# Altium project Autoinformer_v1.1.PrjPcb (part 1 of 2)
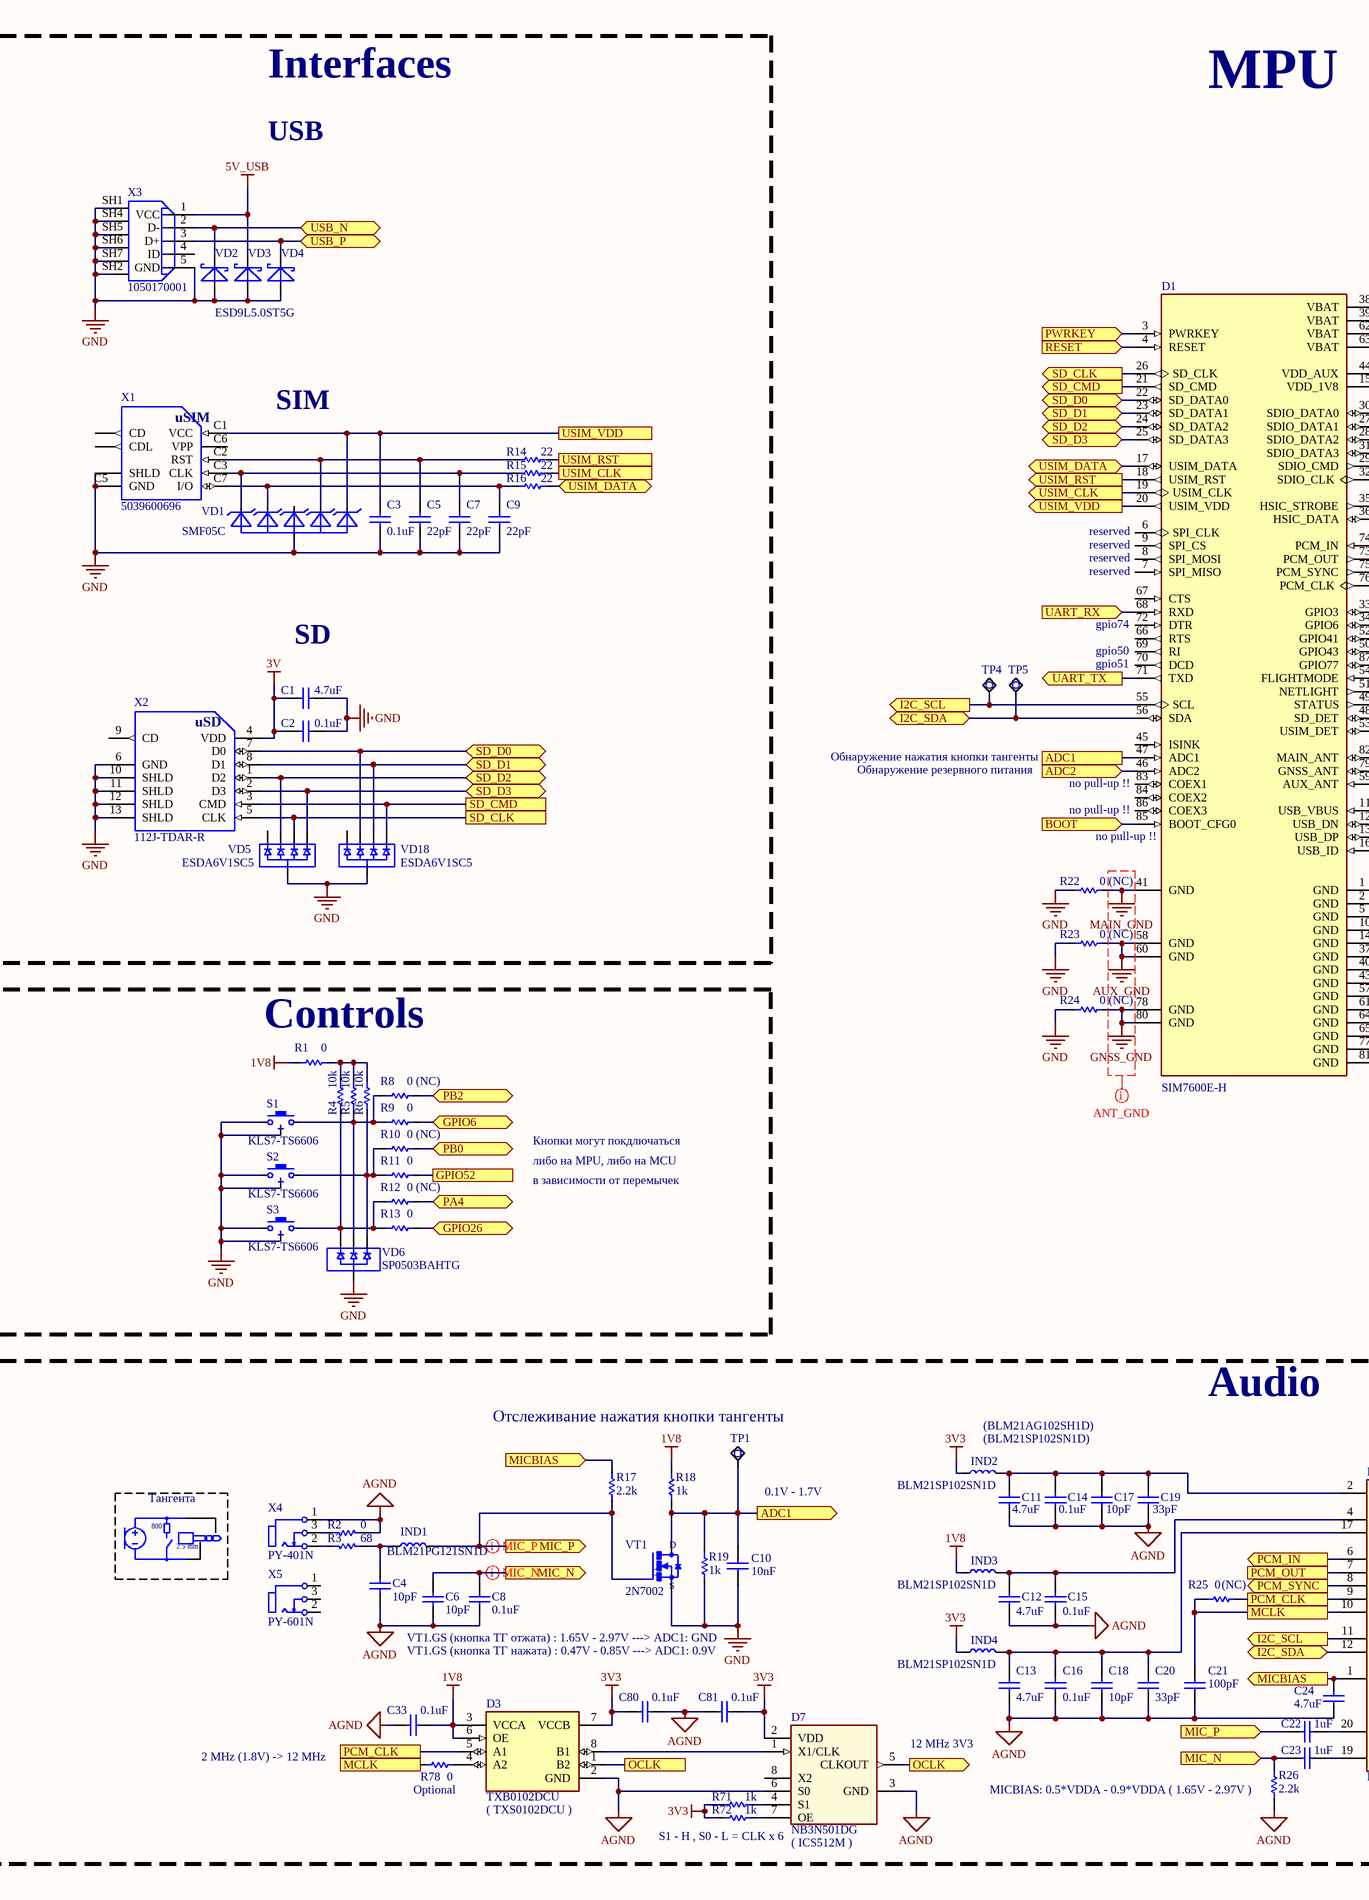
[diagram p0: Sh1_MPU.SchDoc, left]
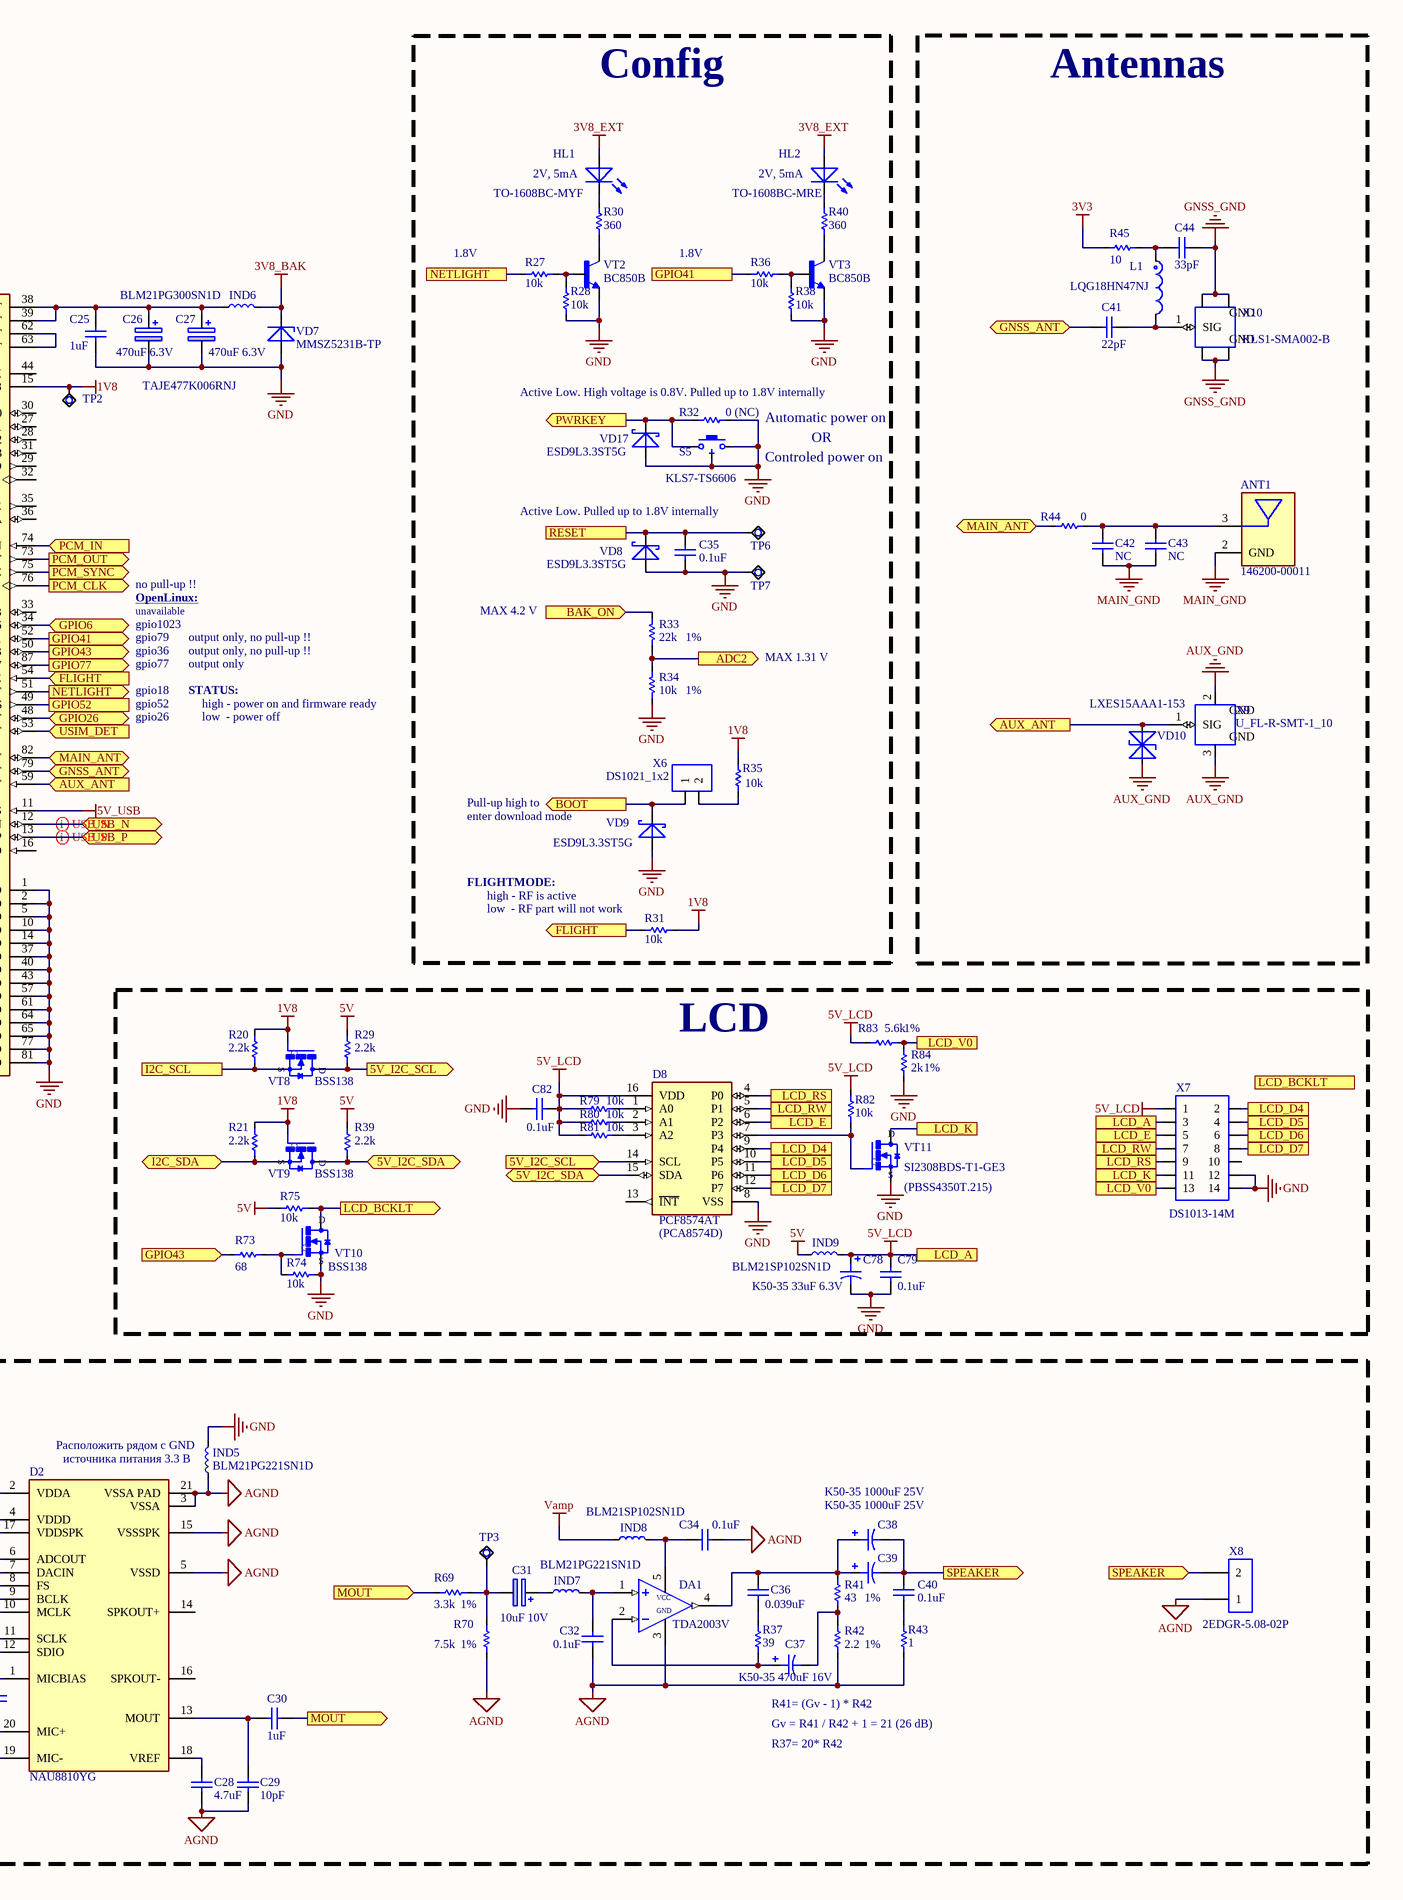
[diagram p1: Sh1_MPU.SchDoc, right]
3 sheets, 272 parts. Net scope: flat (ports and power ports of the same name join across sheets).
Board file: AutoinformerPCB.PcbDoc
Sheets:
  Sh1_MPU.SchDoc
  Sh2_MCU.SchDoc
  Sh3_Power.SchDoc

## Sheet Sh1_MPU.SchDoc
size A2

### Parts
ANT1  146200-00011  [Molex_146200-0011_MFG]
C1  4.7uF  [C_SMD0603]
C2  0.1uF  [C_SMD0603]
C3  0.1uF  [C_SMD0603]
C4  10pF  [C_SMD0603]
C5  22pF  [C_SMD0603]
C6  10pF  [C_SMD0603]
C7  22pF  [C_SMD0603]
C8  0.1uF  [C_SMD0603]
C9  22pF  [C_SMD0603]
C10  10nF  [C_SMD0603]
C11  4.7uF  [C_SMD0603]
C12  4.7uF  [C_SMD0603]
C13  4.7uF  [C_SMD0603]
C14  0.1uF  [C_SMD0603]
C15  0.1uF  [C_SMD0603]
C16  0.1uF  [C_SMD0603]
C17  10pF  [C_SMD0603]
C18  10pF  [C_SMD0603]
C19  33pF  [C_SMD0603]
C20  33pF  [C_SMD0603]
C21  100pF  [C_SMD0603]
C22  1uF  [C_SMD0603]
C23  1uF  [C_SMD0603]
C24  4.7uF  [C_SMD0603]
C25  1uF  [C_SMD0603]
C26  470uF 6.3V  [TECAP_E]
C27  470uF 6.3V  [TECAP_E]
C28  4.7uF  [C_SMD0603]
C29  10pF  [C_SMD0603]
C30  1uF  [C_SMD1206]
C31  10uF 10V  [TECAP_B]
C32  0.1uF  [C_SMD0603]
C33  0.1uF  [C_SMD0402]
C34  0.1uF  [C_SMD0603]
C35  0.1uF  [C_SMD0603]
C36  0.039uF  [C_SMD0603]
C37  K50-35 470uF 16V  [K50-35 8x11.5x3.5]
C38  K50-35 1000uF 25V  [K50-35 10x12.5x5]
C39  K50-35 1000uF 25V  [K50-35 10x12.5x5]
C40  0.1uF  [C_SMD0603]
C41  22pF  [C_SMD0805]
C42  NС  [C_SMD0603]
C43  NС  [C_SMD0603]
C44  33pF  [C_SMD0603]
C78  K50-35 33uF 6.3V  [K50-35mini 4x7x2]
C79  0.1uF  [C_SMD0603]
C80  0.1uF  [C_SMD0402]
C81  0.1uF  [C_SMD0402]
C82  0.1uF  [C_SMD0603]
D1  SIM7600E-H  [IC_SIM7600E-H]
D2  NAU8810YG  [NAU8810YG]
D3  TXB0102DCU  [SOP50P310X90-8N]
D7  NB3N501DG  [SOIC8 (SO-8)]
D8  PCF8574AT  [SOIC127P1032X265-16N]
DA1  TDA2003V  [TDA2003V _HS-117-30 (ABM-161-30)]
HL1  TO-1608BC-MYF  [LED_SMD1608 + THR0254]
HL2  TO-1608BC-MRE  [LED_SMD1608 + THR0254]
IND1  BLM21PG121SN1D  [BLM21PG221_0805]
IND2  BLM21SP102SN1D  [BLM21PG221_0805]
IND3  BLM21SP102SN1D  [BLM21PG221_0805]
IND4  BLM21SP102SN1D  [BLM21PG221_0805]
IND5  BLM21PG221SN1D  [BLM21PG221_0805]
IND6  BLM21PG300SN1D  [BLM21PG221_0805]
IND7  BLM21PG221SN1D  [BLM21PG221_0805]
IND8  BLM21SP102SN1D  [BLM21PG221_0805]
IND9  BLM21SP102SN1D  [BLM21PG221_0805]
L1  LQG18HN47NJ  [L0603]
R1  0  [R_SMD0603]
R2  0  [R_SMD0603]
R3  68  [R_SMD0603]
R4  10k  [R_SMD0603]
R5  10k  [R_SMD0603]
R6  10k  [R_SMD0603]
R8  0 (NC)  [R_SMD0603]
R9  0  [R_SMD0603]
R10  0 (NC)  [R_SMD0603]
R11  0  [R_SMD0603]
R12  0 (NC)  [R_SMD0603]
R13  0  [R_SMD0603]
R14  22  [R_SMD0603]
R15  22  [R_SMD0603]
R16  22  [R_SMD0603]
R17  2.2k  [R_SMD0603]
R18  1k  [R_SMD0603]
R19  1k  [R_SMD0603]
R20  2.2k  [R_SMD0603]
R21  2.2k  [R_SMD0603]
R22  0 (NC)  [R_SMD0805]
R23  0 (NC)  [R_SMD0805]
R24  0 (NC)  [R_SMD0805]
R25  0  [R_SMD0603]
R26  2.2k  [R_SMD0603]
R27  10k  [R_SMD0603]
R28  10k  [R_SMD0603]
R29  2.2k  [R_SMD0603]
R30  360  [R_SMD0603]
R31  10k  [R_SMD0603]
R32  0 (NC)  [R_SMD0603]
R33  22k  [R_SMD0603]
R34  10k  [R_SMD0603]
R35  10k  [R_SMD0603]
R36  10k  [R_SMD0603]
R37  39  [R_SMD0603]
R38  10k  [R_SMD0603]
R39  2.2k  [R_SMD0603]
R40  360  [R_SMD0603]
R41  43  [R_SMD0603]
R42  2.2  [R_SMD0603]
R43  1  [R_SMD0603]
R44  0  [R_SMD0805]
R45  10  [R_SMD0603]
R69  3.3k  [R_SMD0603]
R70  7.5k  [R_SMD0603]
R71  1k  [R_SMD0402]
R72  1k  [R_SMD1206]
R73  68  [R_SMD0603]
R74  10k  [R_SMD0603]
R75  10k  [R_SMD0603]
R78  0  [R_SMD0603]
R79  10k  [R_SMD0603]
R80  10k  [R_SMD0603]
R81  10k  [R_SMD0603]
R82  10k  [R_SMD0603]
R83  5.6k  [R_SMD0603]
R84  2k  [R_SMD0603]
S1  KLS7-TS6606  [KLS7-TS6606 -7.0]
S2  KLS7-TS6606  [KLS7-TS6606 -7.0]
S3  KLS7-TS6606  [KLS7-TS6606 -7.0]
S5  KLS7-TS6606  [KLS7-TS6606 -7.0]
TP1  Test_point  [TEST_POINT]  (value not drawn)
TP2  Test_point  [TEST_POINT]  (value not drawn)
TP3  Test_point  [TEST_POINT]  (value not drawn)
TP4  Test_point  [TEST_POINT]  (value not drawn)
TP5  Test_point  [TEST_POINT]  (value not drawn)
TP6  Test_point  [TEST_POINT]  (value not drawn)
TP7  Test_point  [TEST_POINT]  (value not drawn)
VD1  SMF05C  [SMF05C]
VD2  ESD9L5.0ST5G  [ESD9L5_514AB]  (value not drawn)
VD3  ESD9L5.0ST5G  [ESD9L5_514AB]  (value not drawn)
VD4  ESD9L5.0ST5G  [ESD9L5_514AB]
VD5  ESDA6V1SC5  [SOT23-5]
VD6  SP0503BAHTG  [SP0503BAHTG]
VD7  MMSZ5231B-TP  [SOD-123_3716X135N]
VD8  ESD9L3.3ST5G  [ESD9L5_514AB]
VD9  ESD9L3.3ST5G  [ESD9L5_514AB]
VD10  LXES15AAA1-153  [Murata_LXES15_IPC_A]
VD17  ESD9L3.3ST5G  [ESD9L5_514AB]
VD18  ESDA6V1SC5  [SOT23-5]
VT1  2N7002  [SOT23]
VT2  BC850B  [SOT23-3]
VT3  BC850B  [SOT23-3]
VT8  BSS138  [SOT23-3]
VT9  BSS138  [SOT23-3]
VT10  BSS138  [SOT23-3]
VT11  SI2308BDS-T1-GE3  [SOT23]
X1  5039600696  [MOLEX_uSIM_5039600696]
X2  112J-TDAR-R  [112JTDARR]
X3  1050170001  [MOLEX_1050170001 - compact]
X4  PY-401N  [PY-401N - compact]
X5  PY-601N  [PY-601N - compact]
X6  DS1021_1x2  [PLD2]
X7  DS1013-14M  [IDC-14M]
X8  2EDGR-5.08-02P  [2EDGR-5.08-02P]
X9  U_FL-R-SMT-1_10  [HIROSE_0_MFG]
X10  KLS1-SMA002-B  [SMA-FEMALE-RA - L-KLS1-SMA002-B]

### Blocks framed on the sheet
Interfaces: C1-C3 C5 C7 C9 R14-R16 VD1-VD5 VD18 X1-X3
Config: C35 HL1 HL2 R27 R28 R30-R36 R38 R40 S5 TP6 TP7 VD8 VD9 VD17 VT2 VT3 X6
Antennas: ANT1 C41-C44 L1 R44 R45 VD10 X9 X10
Controls: R1 R4-R6 R8-R13 S1-S3 VD6
LCD: C78 C79 C82 D8 IND9 R20 R21 R29 R39 R73-R75 R79-R84 VT8-VT11 X7
Audio: C4 C6 C8 C10-C24 C28-C34 C36-C40 C80 C81 D2 D3 D7 DA1 IND1-IND5 IND7 IND8 R2 R3 R17-R19 R25 R26 R37 R41-R43 R69-R72 R78 TP1 TP3 VT1 X4 X5 X8

### Ports
5V_I2C_SCL (in), 5V_I2C_SCL (out), 5V_I2C_SDA (bidir), ADC1, ADC1 (out), ADC2 (in), ADC2 (out), AUX_ANT (in), AUX_ANT (out), BAK_ON (in), BOOT (in), BOOT (out), FLIGHT (in), FLIGHT (out), GNSS_ANT (bidir), GPIO6 (bidir), GPIO26 (bidir), GPIO41, GPIO41 (out), GPIO43 (in), GPIO43 (out), GPIO52, GPIO77 (out), I2C_SCL, I2C_SCL (out), I2C_SDA (bidir), LCD_A, LCD_BCKLT (in), LCD_BCKLT (out), LCD_D4, LCD_D5, LCD_D6, LCD_D7, LCD_E, LCD_K, LCD_RS, LCD_RW, LCD_V0, MAIN_ANT (bidir), MCLK, MCLK (out), MIC_N (in), MIC_N (out), MIC_P (in), MIC_P (out), MICBIAS (in), MICBIAS (out), MOUT (in), MOUT (out), NETLIGHT, NETLIGHT (out), OCLK, OCLK (out), PA4 (bidir), PB0 (bidir), PB2 (bidir), PCM_CLK, PCM_CLK (out), PCM_IN (in), PCM_IN (out), PCM_OUT, PCM_OUT (out), PCM_SYNC (out), PWRKEY (in), PWRKEY (out), RESET, RESET (in), SD_CLK, SD_CLK (out), SD_CMD, SD_CMD (out), SD_D0 (bidir), SD_D1 (bidir), SD_D2 (bidir), SD_D3 (bidir), SPEAKER (in), SPEAKER (out), UART_RX (in), UART_TX (out), USB_N (bidir), USB_P (bidir), USIM_CLK, USIM_CLK (out), USIM_DATA (bidir), USIM_DET (in), USIM_RST, USIM_RST (out), USIM_VDD, USIM_VDD (out)

### Nets
1V8: C33.2 D1.15(VDD_1V8) D3.3(VCCA) D3.6(OE) IND3.1 R1.2(CW) R18.1(CCW) R20.2(CW) R21.2(CW) R31.2(CW) R35.1(CCW) TP2.1 VT8.1(G) VT9.1(G)
3V: C1.2 C2.2 X2.4(VDD)
3V3: C80.1 C81.2 D3.7(VCCB) D7.2(VDD) IND2.1 IND4.1 R45.2(CW) R71.1(CCW) R72.1(CCW)
3V8_BAK: IND6.2 VD7.C(NEG)
3V8_EXT: HL1.1(POS) HL2.1(POS)
5V: IND9.1 R29.1(CCW) R39.2(CW) R75.2(CW)
5V_LCD: C78.1 C79.2 C82.1 D8.16(VDD) IND9.2 R79.2(CW) R80.2(CW) R81.2(CW) R82.1(CCW) R83.2(CW) X7.1 X7.3 ; port LCD_A
5V_USB: D1.11(USB_VBUS) VD3.2(NEG) X3.1(VCC)
AGND: C4.2 C6.1 C8.2 C11.2 C12.2 C13.2 C14.2 C15.2 C16.2 C17.2 C18.2 C19.2 C20.2 C21.1 C24.1 C28.1 C29.1 C32.2 C33.1 C34.2 C80.2 C81.1 D2.3(VSSA) D2.5(VSSD) D2.15(VSSSPK) D2.21(VSSA_PAD) D3.2(GND) D7.3(GND) D7.6(S0) DA1.3(GND) IND5.1 R2.1(CCW) R26.2(CW) R42.2(CW) R43.2(CW) R70.2(CW) X4.1 X8.1
AUX_GND: D1.58(GND) D1.60(GND) R23.2(CW) VD10.1(A) X9.2(GND) X9.3(GND)
GND: C1.1 C2.1 C3.2 C5.2 C7.2 C9.2 C10.2 C25.2 C26.2(-) C27.2(-) C35.2 C78.2 C79.1 C82.2 D1.1(GND) D1.2(GND) D1.5(GND) D1.10(GND) D1.14(GND) D1.37(GND) D1.40(GND) D1.43(GND) D1.57(GND) D1.61(GND) D1.64(GND) D1.65(GND) D1.77(GND) D1.81(GND) D8.8(VSS) IND5.2 R19.2(CW) R22.1(CCW) R23.1(CCW) R24.1(CCW) R28.1(CCW) R32.2(CW) R34.1(CCW) R38.1(CCW) R74.1(CCW) R84.2(CW) S1.2 S1.SH(SHLD) S2.2 S2.SH(SHLD) S3.2 S3.SH(SHLD) S5.2 S5.SH(SHLD) TP7.1 VD1.2(A) VD2.1(POS) VD3.1(POS) VD4.1(POS) VD5.2(GND) VD6.1(GND) VD7.A(POS) VD8.1(POS) VD9.1(POS) VD17.1(POS) VD18.2(GND) VT1.2(S) VT2.2(E) VT3.2(E) VT10.2(S) VT11.2(S) X1.C5(GND) X1.SHLD X2.6(GND) X2.10(SHLD) X2.11(SHLD) X2.12(SHLD) X2.13(SHLD) X3.5(GND) X3.SH1(SHIELD) X3.SH2(SHIELD) X3.SH4(SHIELD) X3.SH5(SHIELD) X3.SH6(SHIELD) X3.SH7(SHIELD) X7.12 X7.14
GNSS_GND: C44.1 D1.78(GND) D1.80(GND) R24.2(CW) X10.G(GND)
MAIN_GND: ANT1.2(GND) C42.1 C43.1 D1.41(GND) R22.2(CW)
Vamp: IND8.1
5V_I2C_SCL: D8.14(SCL) R29.2(CW) VT8.3(D) ; port 5V_I2C_SCL
5V_I2C_SDA: D8.15(SDA) R39.1(CCW) VT9.3(D) ; port 5V_I2C_SDA
ADC1: C10.1 D1.47(ADC1) R18.2(CW) R19.1(CCW) TP1.1 VT1.3(D) ; port ADC1
ADC2: D1.46(ADC2) R33.1(CCW) R34.2(CW) ; port ADC2
AUX_ANT: D1.59(AUX_ANT) VD10.2(K) X9.1(SIG) ; port AUX_ANT
BAK_ON: R33.2(CW) ; port BAK_ON
BOOT: D1.85(BOOT_CFG0) VD9.2(NEG) X6.1 ; port BOOT
FLIGHT: D1.54(FLIGHTMODE) R31.1(CCW) ; port FLIGHT
GNSS_ANT: C41.2 D1.79(GNSS_ANT) ; port GNSS_ANT
GPIO6: D1.34(GPIO6) R9.1(CCW) ; port GPIO6
GPIO26: D1.48(SD_DET) R13.1(CCW) ; port GPIO26
GPIO41: D1.52(GPIO41) R36.1(CCW) ; port GPIO41
GPIO43: D1.50(GPIO43) R73.1(CCW) ; port GPIO43
GPIO52: D1.49(STATUS) R11.1(CCW) ; port GPIO52
GPIO77: D1.87(GPIO77) ; port GPIO77
I2C_SCL: D1.55(SCL) D2.11(SCLK) R20.1(CCW) TP4.1 VT8.2(S) ; port I2C_SCL
I2C_SDA: D1.56(SDA) D2.12(SDIO) R21.1(CCW) TP5.1 VT9.2(S) ; port I2C_SDA
LCD_BCKLT: R75.1(CCW) VT10.3(D) ; port LCD_BCKLT
LCD_D4: D8.9(P4) X7.2 ; port LCD_D4
LCD_D5: D8.10(P5) X7.4 ; port LCD_D5
LCD_D6: D8.11(P6) X7.6 ; port LCD_D6
LCD_D7: D8.12(P7) X7.8 ; port LCD_D7
LCD_E: D8.6(P2) X7.5 ; port LCD_E
LCD_K: VT11.3(D) X7.11 ; port LCD_K
LCD_RS: D8.4(P0) X7.9 ; port LCD_RS
LCD_RW: D8.5(P1) X7.7 ; port LCD_RW
LCD_V0: R83.1(CCW) R84.1(CCW) X7.13 ; port LCD_V0
MAIN_ANT: D1.82(MAIN_ANT) R44.1(CCW) ; port MAIN_ANT
MCLK: C21.2 D2.10(MCLK) R25.2(CW) R78.2(CW) ; port MCLK
MIC_N: C6.2 C8.1 C23.1 R26.1(CCW) ; port MIC_N
MIC_P: C22.1 IND1.1 R17.2(CW) VT1.1(G) ; port MIC_P
MICBIAS: C24.2 D2.1(MICBIAS) R17.1(CCW) ; port MICBIAS
MOUT: C30.1 R69.1(CCW) ; port MOUT
NETLIGHT: D1.51(NETLIGHT) R27.1(CCW) ; port NETLIGHT
OCLK: D3.1(B2) D7.5(CLKOUT) ; port OCLK
PA4: R12.1(CCW) ; port PA4
PB0: R10.1(CCW) ; port PB0
PB2: R8.1(CCW) ; port PB2
PCM_CLK: D1.76(PCM_CLK) D2.9(BCLK) D3.5(A1) R25.1(CCW) ; port PCM_CLK
PCM_IN: D1.74(PCM_IN) D2.6(ADCOUT) ; port PCM_IN
PCM_OUT: D1.73(PCM_OUT) D2.7(DACIN) ; port PCM_OUT
PCM_SYNC: D1.75(PCM_SYNC) D2.8(FS) ; port PCM_SYNC
PWRKEY: D1.3(PWRKEY) R32.1(CCW) S5.1 VD17.2(NEG) ; port PWRKEY
RESET: C35.1 D1.4(RESET) TP6.1 VD8.2(NEG) ; port RESET
SD_CLK: D1.26(SD_CLK) VD5.4(B) X2.5(CLK) ; port SD_CLK
SD_CMD: D1.21(SD_CMD) VD18.5(D) X2.3(CMD) ; port SD_CMD
SD_D0: D1.22(SD_DATA0) VD18.3(C) X2.7(D0) ; port SD_D0
SD_D1: D1.23(SD_DATA1) VD18.4(B) X2.8(D1) ; port SD_D1
SD_D2: D1.24(SD_DATA2) VD5.3(C) X2.1(D2) ; port SD_D2
SD_D3: D1.25(SD_DATA3) VD5.5(D) X2.2(D3) ; port SD_D3
SPEAKER: C38.2 C39.2 C40.1 X8.2 ; port SPEAKER
UART_RX: D1.68(RXD) ; port UART_RX
UART_TX: D1.71(TXD) ; port UART_TX
USB_N: D1.12(USB_DN) VD2.2(NEG) X3.2(D-) ; port USB_N
USB_P: D1.13(USB_DP) VD4.2(NEG) X3.3(D+) ; port USB_P
USIM_CLK: D1.19(USIM_CLK) R15.1(CCW) ; port USIM_CLK
USIM_DATA: D1.17(USIM_DATA) R16.1(CCW) ; port USIM_DATA
USIM_DET: D1.53(USIM_DET) ; port USIM_DET
USIM_RST: D1.18(USIM_RST) R14.1(CCW) ; port USIM_RST
USIM_VDD: C3.1 D1.20(USIM_VDD) VD1.6(C5) X1.C1(VCC) ; port USIM_VDD
NetANT1_3: ANT1.3(FEEDING) C42.2 C43.2 R44.2(CW)
NetC4_1: C4.1 IND1.2 R3.1(CCW)
NetC5_1: C5.1 R14.2(CW) VD1.5(C4) X1.C2(RST)
NetC7_1: C7.1 R15.2(CW) VD1.1(C1) X1.C3(CLK)
NetC9_1: C9.1 R16.2(CW) VD1.3(C2) X1.C7(I/O)
NetC11_1: C11.1 C14.1 C17.1 C19.1 D2.2(VDDA) IND2.2
NetC12_1: C12.1 C15.1 D2.4(VDDD) IND3.2
NetC13_1: C13.1 C16.1 C18.1 C20.1 D2.17(VDDSPK) IND4.2
NetC22_2: C22.2 D2.20(MIC+)
NetC23_2: C23.2 D2.19(MIC-)
NetC25_1: C25.1 C26.1(+) C27.1(+) D1.38(VBAT) D1.39(VBAT) IND6.1
NetC28_2: C28.2 D2.18(VREF)
NetC29_2: C29.2 C30.2 D2.13(MOUT)
NetC31_1: C31.1(+) IND7.1
NetC31_2: C31.2(-) R69.2(CW) R70.1(CCW) TP3.1
NetC32_1: C32.1 DA1.1(+IN) IND7.2
NetC34_1: C34.1 DA1.5(VCC) IND8.2
NetC36_1: C36.1 C38.1 C39.1 DA1.4(OUT) R41.1(CCW)
NetC36_2: C36.2 R37.1(CCW)
NetC37_1: C37.1 DA1.2(-IN) R37.2(CW)
NetC37_2: C37.2 R41.2(CW) R42.1(CCW)
NetC40_2: C40.2 R43.1(CCW)
NetC41_1: C41.1 L1.2 X10.1(SIG)
NetC44_2: C44.2 L1.1 R45.1(CCW)
NetD1_62: D1.62(VBAT) D1.63(VBAT)
NetD3_4: D3.4(A2) R78.1(CCW)
NetD3_8: D3.8(B1) D7.1(X1/CLK)
NetD7_4: D7.4(S1) R71.2(CW)
NetD7_7: D7.7(OE) R72.2(CW)
NetD8_1: D8.1(A0) R79.1(CCW)
NetD8_2: D8.2(A1) R80.1(CCW)
NetD8_3: D8.3(A2) R81.1(CCW)
NetD8_7: D8.7(P3) R82.2(CW) VT11.1(G)
NetHL1_2: HL1.2(NEG) R30.2(CW)
NetHL2_2: HL2.2(NEG) R40.2(CW)
NetR1_1: R1.1(CCW) R4.2(CW) R5.2(CW) R6.2(CW)
NetR2_2: R2.2(CW) X4.3
NetR3_2: R3.2(CW) X4.2
NetR4_1: R4.1(CCW) R12.2(CW) R13.2(CW) S3.1 VD6.2(A)
NetR5_1: R5.1(CCW) R8.2(CW) R9.2(CW) S1.1 VD6.4(C)
NetR6_1: R6.1(CCW) R10.2(CW) R11.2(CW) S2.1 VD6.3(B)
NetR27_2: R27.2(CW) R28.2(CW) VT2.1(B)
NetR30_1: R30.1(CCW) VT2.3(C)
NetR35_2: R35.2(CW) X6.2
NetR36_2: R36.2(CW) R38.2(CW) VT3.1(B)
NetR40_1: R40.1(CCW) VT3.3(C)
NetR73_2: R73.2(CW) R74.2(CW) VT10.1(G)

Not connected (* = marked no-connect by the designer): D1 6(SPI_CLK) 7(SPI_MISO) 8(SPI_MOSI) 9(SPI_CS) 16(USB_ID) 27(SDIO_DATA1) 28(SDIO_DATA2) 29(SDIO_CMD) 30(SDIO_DATA0) 31(SDIO_DATA3) 32(SDIO_CLK) 33(GPIO3) 35(HSIC_STROBE) 36(HSIC_DATA) 44(VDD_AUX) 45(ISINK) 66(RTS) 67(CTS) 69(RI) 70(DCD) 72(DTR) 83(COEX1) 84(COEX2) 86(COEX3); D2 14(SPKOUT+) 16(SPKOUT-); D7 8(X2); D8 13(~{INT}); VD1 4(C3); VD5 1(A); VD18 1(A); X1 C6(VPP) CD CDL; X2 9(CD); X3 4(ID); X5 1 2 3; X7 10

### Layout directives
differential pair: MIC_N, MIC_P, USB_N, USB_P
net class ANT_GND_Nets: AUX_GND, GNSS_GND, MAIN_GND

### Notes on the sheet
- MPU
- USB
- 2V, 5mA
- (near R27) 1.8V
- 1.8V
- SIM
- TAJE477K006RNJ
- Active Low. High voltage is 0.8V. Pulled up to 1.8V internally
- Automatic power on
- Controled power on
- OR
- (near D1) reserved
- (near TP6) Active Low. Pulled up to 1.8V internally
- (near D1) gpio74
- gpio1023
- unavailable
- OpenLinux:
- no pull-up !!
- MAX 4.2 V
- (near C1) SD
- (near D1) gpio51
- (near D1) gpio50
- gpio18
- gpio79
- gpio36
- gpio77
- output only, no pull-up !!
- output only
- STATUS:
- 1%
- MAX 1.31 V
- Обнаружение нажатия кнопки тангенты
- gpio26
- gpio52
- high - power on and firmware ready
- low  - power off
- Обнаружение резервного питания
- (near D1) no pull-up !!
- Pull-up high to
- enter download mode
- FLIGHTMODE:
- high - RF is active
- (near R31) low  - RF part will not work
- Кнопки могут покдлючаться
- либо на MPU, либо на MCU
- в зависимости от перемычек
- (near VT11) (PBSS4350T.215)
- (near D8) (PCA8574D)
- Отслеживание нажатия кнопки тангенты
- (near TP1) 0.1V - 1.7V
- (near IND2) (BLM21SP102SN1D)
- (BLM21AG102SH1D)
- (near IND5) Расположить рядом с GND
- (near IND5) источника питания 3.3 В
- Тангента
- 800
- 2.5 mm
- (near R25) (NC)
- (near R69) 1%
- VT1.GS (кнопка ТГ нажата) : 0.47V - 0.85V ---> ADC1: 0.9V
- VT1.GS (кнопка ТГ отжата) : 1.65V - 2.97V ---> ADC1: GND
- (near R70) 1%
- 2 MHz (1.8V) -> 12 MHz
- (near D7) 12 MHz 3V3
- R41= (Gv - 1) * R42
- R37= 20* R42
- Gv = R41 / R42 + 1 = 21 (26 dB)
- Optional
- (near D3) ( TXS0102DCU )
- (near R26) MICBIAS: 0.5*VDDA - 0.9*VDDA ( 1.65V - 2.97V )
- S1 - H , S0 - L = CLK x 6
- (near D7) ( ICS512M )
- Title
- Size:
- Date:
- File:
- A2
- Number:
- Time:
- Revision:
- Sheet
- of
- (in symbol microSD_112J-TDAR-R) uSD
- (in symbol microSIM_Holder_5039600696) uSIM

### Library data of the parts
ANT1 = 146200-0001(11): LTE Cellular Ceramic Antenna 698MHz-2.7GHz , SMT; ComponentLink1Description: elitan; ComponentLink1URL: https://www.elitan.ru/price/item17428368
C1 C11-C13 C24 C28 = C_SMD: GRM188R60J475KE19D; ComponentLink1Description: chipdip; ComponentLink1URL: https://www.chipdip.ru/product/grm188r60j475ke19d; ComponentLink2Description: el; ComponentLink2URL: https://www.electronshik.ru/item/MUR/GRM188R60J475KE19D
C2 C3 C8 C14-C16 C32 C34 C35 C40 C79 C82 = C_SMD: GRM188R71H104KA93D; ComponentLink1Description: chipdip; ComponentLink1URL: https://www.chipdip.ru/product0/226236018; ComponentLink2Description: el; ComponentLink2URL: https://www.electronshik.ru/item/MUR/GRM188R71H104KA93D
C4 C6 C17 C18 C29 = C_SMD: GRM1885C1H100J; ComponentLink1Description: chipdip; ComponentLink1URL: https://www.chipdip.ru/product/grm1885c1h100j; ComponentLink2Description: el; ComponentLink2URL: https://www.electronshik.ru/item/MUR/GRM1885C1H100JA01D
C5 C7 C9 = C_SMD: GRM1885C1H220JA01D; ComponentLink1Description: chipdip; ComponentLink1URL: https://www.chipdip.ru/product/grm1885c1h220j; ComponentLink2Description: el; ComponentLink2URL: https://www.electronshik.ru/item/MUR/GRM1885C1H220JA01D
C10 = C_SMD: GRM188R71H103K; ComponentLink1Description: chipdip; ComponentLink1URL: https://www.chipdip.ru/product0/9000143994; ComponentLink2Description: el; ComponentLink2URL: https://www.electronshik.ru/item/MUR/GRM188R71H103KA01D
C19 C20 C44 = C_SMD: GRM1885C1H330J; ComponentLink1Description: chipdip; ComponentLink1URL: https://www.chipdip.ru/product0/565764982; ComponentLink2Description: el; ComponentLink2URL: https://www.electronshik.ru/item/MUR/GRM1885C1H330JA01D
C21 = C_SMD: GRM1885C1H101J; ComponentLink1Description: chipdip-100pf; ComponentLink1URL: https://www.chipdip.ru/product0/305749128; ComponentLink2Description: el; ComponentLink2URL: https://www.electronshik.ru/item/MUR/GRM1885C1H101JA01D
C22 C23 C25 = C_SMD: GRM188R71E105KA12D; ComponentLink1Description: chipdip; ComponentLink1URL: https://www.chipdip.ru/product/grm188r71e105ka12d; ComponentLink2Description: el; ComponentLink2URL: https://www.electronshik.ru/item/MUR/GRM188R71E105KA12D
C26 C27 = C_SMD_Tantalum: 293D477X06R3E2TE3 / Конденсатор танталовый SMD тип Е; ComponentLink1Description: 470uF-10V-chipdip; ComponentLink1URL: https://www.chipdip.ru/product0/145634327?from=suggest_product; ComponentLink2Description: el; ComponentLink2URL: https://www.electronshik.ru/item/VISHAY/293D477X06R3E2TE3
C30 = C_SMD: GRM31MR71E105KA01L; ComponentLink1Description: chipdip; ComponentLink1URL: https://www.chipdip.ru/product/grm31mr71e105k; ComponentLink2Description: el; ComponentLink2URL: https://www.electronshik.ru/item/MUR/GRM31MR71E105KA01L
C31 = C_SMD_Tantalum: TAJB106K016RNJ / Конденсатор танталовый SMD 10uF 10V тип B; ComponentLink1Description: chipdip; ComponentLink1URL: https://www.chipdip.ru/product0/146061461?from=suggest_product; ComponentLink2Description: el; ComponentLink2URL: https://www.electronshik.ru/item/AVX/TAJB106K016RNJ
C33 C80 C81 = C_SMD: CL05B104KO5NNNC; ComponentLink1Description: chipdip; ComponentLink1URL: https://www.chipdip.ru/product1/8001849671?from=suggest_product; ComponentLink2Description: el; ComponentLink2URL: https://www.electronshik.ru/item/SAMSUNG/CL05B104KO5NNNC
C36 = C_SMD: CC0603KRX7R9BB393; ComponentLink1Description: chipdip; ComponentLink1URL: https://www.chipdip.ru/product0/8160066189?from=suggest_product; ComponentLink2Description: elitan; ComponentLink2URL: https://www.elitan.ru/price/item8778633; ComponentLink3Description: el; ComponentLink3URL: https://www.electronshik.ru/item/YAG/CC0603KRX7R9BB393
C37 = K50-35: Конденсатор электролитический алюминиевый 470мкФ, 16В 8х12мм Р:3.5мм; ComponentLink1Description: chipdip; ComponentLink1URL: https://www.chipdip.ru/product0/9000565914
C38 C39 = K50-35: Конденсатор электролитический алюминиевый 1000мкФ, 16В, 10x21мм; ComponentLink1Description: chipdip; ComponentLink1URL: https://www.chipdip.ru/product0/9000565765?from=suggest_product
C41 = C_SMD: GRM21A5C2E220J; ComponentLink1Description: chipdip; ComponentLink1URL: https://www.chipdip.ru/product0/29844; ComponentLink2Description: el; ComponentLink2URL: https://www.electronshik.ru/item/MUR/GRM21A5C2E220JW01D
C42 C43 = C_SMD: 0603 SMD Capacitor
C78 = K50-35: Конденсатор электролитический алюминиевый 33 мкФ, 6.3 В, 4х7мм; ComponentLink1Description: (К50-35 мини), 33 мкФ, 6.3 В, 4х7мм; ComponentLink1URL: https://www.chipdip.ru/product0/9000261769
D1 = SIM7600E-H: Multi-Band LTE-TDD/LTE-FDD/HSPA+ and GSM/GPRS/EDGE module; MF: Simcom; MP: SIM7600E-H; Availability: Unavailable; Package: None; Value: *; Price: None; SnapEDA_Link: https://www.snapeda.com/parts/SIM7600E-H/SIMcom%20Wireless%20solutions%20Co.%2CLtd/view-part/2758290/?ref=snap; ComponentLink1Description: mt-systems; ComponentLink1URL: http://www.mt-system.ru/SIMCom/SIM7600E-H
D2 = NAU8810YG: AUDIO CODEC MONO 20QFN; Manufacturer: Nuvoton Technology Corporation; Voltage: 3.6V; helpURL: https://upverter.com/upn/revision/eec1ccdac07fe113/; ComponentLink2Description: Datasheet; Temperature: -40°C to +85°C; Package: QFN20; Supplier 2: Mouser; Supplier 1: Digi-Key; ComponentLink1URL: https://upverter.com/upn/revision/eec1ccdac07fe113/; Supplier Part Number 1: NAU8810YG-ND; ComponentLink1Description: Upverter; ComponentLink2URL: http://www.nuvoton.com/hq/resource-download.jsp?tp_GUID=DA00-NAU8810.1; RoHS: TRUE; Ipc Land Pattern Name: QFN50P400X400X75-20; Temperature Range High: +85°C; Digikey Description: IC AUDIO CODEC MONO 20QFN; Digikey Part Number: NAU8810YG-ND; Lead Free: yes; Temperature Range Low: -40°C; ComponentLink3Description: elitan; ComponentLink3URL: https://www.elitan.ru/price/index.php?find=NAU8810YG&delay=-1&mfg=all&seenform=y
D3 = TXB0102: Voltage Level Translator Bidirectional 1 Circuit 2 Channel 100Mbps 8-VSSOP; MF: Texas Instruments; Package: VFSOP-8 Texas Instruments; Value: *; Price: None; MP: TXB0102; SnapEDA_Link: https://www.snapeda.com/parts/TXB0102/Texas%20Instruments/view-part/547662/?ref=snap; Availability: Unavailable; ComponentLink1Description: elitan; ComponentLink1URL: https://www.elitan.ru/price/item692394; ComponentLink2Description: chipdip; ComponentLink2URL: https://www.chipdip.ru/product0/8002872138?from=suggest_product; ComponentLink3Description: electronshik; ComponentLink3URL: https://www.electronshik.ru/item/TI/TXB0102DCUR
D7 = NB3N501DG: PLL Clock Multiplier Single 8-Pin SOIC 3 V ~ 5.25 V; ComponentLink1Description: elitan; ComponentLink1URL: https://www.elitan.ru/price/item9787428; ComponentLink2Description: electronshik; ComponentLink2URL: https://www.electronshik.ru/item/ONS/NB3N501DG
D8 = PCF8574AT: 8-bit I/O expander for I2C bus with interrupt / PCF8574(A)T/3 - 100kHz version / PCA8574(A)D - 400kHz version; MF: NXP Semiconductors; Value: *; SnapEDA_Link: https://www.snapeda.com/parts/PCF8574AT/NXP%20Semiconductors/view-part/4220694/?ref=snap; Price: None; Availability: Unavailable; Package: None; MP: PCF8574AT; ComponentLink1Description: elitan; ComponentLink1URL: https://www.elitan.ru/price/item981552; ComponentLink2Description: elitan - pca8574D; ComponentLink2URL: https://www.elitan.ru/price/item537810
DA1 = TDA2003V: Amplifier IC 1-Channel _Mono_ Class AB 5-PENTAWATT 10W; MF: STMicroelectronics; Price: None; Availability: Unavailable; Package: Pentawatt-5 STMicroelectronics; MP: TDA2003V; Value: *; SnapEDA_Link: https://www.snapeda.com/parts/TDA2003V/STMicroelectronics/view-part/39407/?ref=snap; ComponentLink1Description: elitan; ComponentLink1URL: https://www.elitan.ru/price/item123031; ComponentLink2Description: chipdip; ComponentLink2URL: https://www.chipdip.ru/product/tda2003v?from=suggest_product; ComponentLink3Description: chipdip-radiator; ComponentLink3URL: https://www.chipdip.ru/product/hs-117-30
HL1 = LED_SMD: Vf =2 V, 20mA, 0603 (HL-PST-1608S31YC); ComponentLink1Description: chipdip-yellow-smd; ComponentLink1URL: https://www.chipdip.ru/product/to-1608bc-myf?from=suggest_product; ComponentLink2Description: chipdip-orange-thr3mm; ComponentLink2URL: https://www.chipdip.ru/product/gnl-3012ed; ComponentLink3Description: el; ComponentLink3URL: https://www.electronshik.ru/item/HONGLI/HL-PST-1608S31YC
HL2 = LED_SMD: Vf =2 V, 20mA, 0603 (HL-PST-1608S9AC); ComponentLink1Description: chipdip-red-smd; ComponentLink1URL: https://www.chipdip.ru/product/to-1608bc-mre?from=suggest_product; ComponentLink2Description: elitan-red-smd; ComponentLink2URL: https://www.elitan.ru/price/item16986056; ComponentLink3Description: chipdip-orange-thr3mm; ComponentLink3URL: https://www.chipdip.ru/product/gnl-3012ed; ComponentLink4Description: el; ComponentLink4URL: https://www.electronshik.ru/item/HONGLI/HL-PST-1608S9AC-04
IND1 = BLM21PG221SN1D: 0805, Дроссель подавления ЭМП 120Ohm 25% 100MHz 3A; ComponentLink1Description: 120Ohm-3A-chipdip; ComponentLink1URL: https://www.chipdip.ru/product0/8228217893; ComponentLink2Description: 120Ohm-3A-elitan; ComponentLink2URL: https://www.elitan.ru/price/item1364359
IND2-IND4 IND8 IND9 = BLM21PG221SN1D: 0805, Дроссель подавления ЭМП 1KOhm 25% 100MHz 1.6A 0.12Ohm; ComponentLink1Description: chipdip; ComponentLink1URL: https://www.chipdip.ru/product/blm21sp102sn1d; ComponentLink2Description: elitan; ComponentLink2URL: https://www.elitan.ru/price/item21298136
IND5 IND7 = BLM21PG221SN1D: 0805, Дроссель подавления ЭМП 220Ohm +25% 100MHz 2A 45mOhm; ComponentLink1Description: chipdip; ComponentLink1URL: https://www.chipdip.ru/product/blm21pg221sn1d; ComponentLink2Description: elitan; ComponentLink2URL: https://www.elitan.ru/price/item305175
IND6 = BLM21PG221SN1D: 0805, Дроссель подавления ЭМП 100МГц:30Ом; 3А; ComponentLink1Description: chipdip; ComponentLink1URL: https://www.chipdip.ru/product/blm21pg300sn1d; ComponentLink2Description: elitan; ComponentLink2URL: https://www.elitan.ru/price/item310735
L1 = LQG18HN47NJ: Чип индуктивность многослойная неэкранированная 47нГн 5% 100МГц / Maximum DC Current 300 mA / Maximum DC Resistance 700 mOhms; ComponentLink1Description: elitan; ComponentLink1URL: https://www.elitan.ru/price/item307313; ComponentLink2Description: chipdip; ComponentLink2URL: https://www.chipdip.ru/product/lqg18hn47nj?from=suggest_product
R1 R2 R8-R13 R25 R32 R78 = R_SMD: RC0603JR-070RL; ComponentLink1Description: chipdip; ComponentLink1URL: https://www.chipdip.ru/product0/9000070541; ComponentLink2URL: https://www.electronshik.ru/item/YAG/RC0603JR-070RL
  R1: ComponentLink2Description: electronsshik
  R2 R9-R13 R25 R32 R78: ComponentLink2Description: el
  R8: ComponentLink2Description: electronshik
R3 R73 = R_SMD: RC0603FR-0768RL; ComponentLink1Description: chipdip; ComponentLink1URL: https://www.chipdip.ru/product0/9000079612; ComponentLink2Description: el; ComponentLink2URL: https://www.electronshik.ru/item/YAG/RC0603FR-0768RL
R4-R6 R27 R28 R31 R34-R36 R38 R74 R75 R79-R82 = R_SMD: RC0603FR-0710KL (CRCW060310K0FKEA); ComponentLink1Description: chipdip; ComponentLink1URL: https://www.chipdip.ru/product0/9000079736; ComponentLink2URL: https://www.electronshik.ru/item/VISHAY/CRCW060310K0FKEA
  R4-R6 R34: ComponentLink2Description: electronshik
  R27 R28 R31 R35 R36 R38 R74 R75 R79-R82: ComponentLink2Description: el
R14-R16 = R_SMD: RC0603FR-0722RL (RC0603JR-0722RL); ComponentLink1Description: chipdip; ComponentLink1URL: https://www.chipdip.ru/product0/9000079564; ComponentLink2Description: electronshik; ComponentLink2URL: https://www.electronshik.ru/item/FENGHUA/0603%20-22%20%D0%9E%D0%BC%205%25%20RC0603JR-0722RL%20%5BRS-03K220JT%5D
R17 R20 R21 R26 R29 R39 = R_SMD: RC0603FR-072K2L; ComponentLink1Description: chipdip; ComponentLink1URL: https://www.chipdip.ru/product0/9000079720; ComponentLink2Description: el; ComponentLink2URL: https://www.electronshik.ru/item/YAG/RC0603FR-072K2L
R18 R19 = R_SMD: RC0603FR-071KL; ComponentLink1Description: chipdip; ComponentLink1URL: https://www.chipdip.ru/product0/9000079676; ComponentLink2Description: el; ComponentLink2URL: https://www.electronshik.ru/item/YAG/RC0603FR-071KL
R22-R24 R44 = R_SMD: RC0805JR-070RL; ComponentLink1Description: chipdip; ComponentLink1URL: https://www.chipdip.ru/product0/153356071; ComponentLink2Description: el; ComponentLink2URL: https://www.electronshik.ru/item/YAG/RC0805JR-070RL
R30 R40 = R_SMD: RC0603FR-07360RL; ComponentLink1Description: chipdip; ComponentLink1URL: https://www.chipdip.ru/product0/9000079629; ComponentLink2Description: el; ComponentLink2URL: https://www.electronshik.ru/item/YAG/RC0603FR-07360RL
R33 = R_SMD: RC0603FR-0722KL; ComponentLink1Description: chipdip; ComponentLink1URL: https://www.chipdip.ru/product0/9000079744; ComponentLink2Description: electronshik; ComponentLink2URL: https://www.electronshik.ru/item/YAG/RC0603FR-0722KL
R37 = R_SMD: RC0603FR-0739RL; ComponentLink1Description: chipdip; ComponentLink1URL: https://www.chipdip.ru/product0/9000079606; ComponentLink2Description: el; ComponentLink2URL: https://www.electronshik.ru/item/YAG/RC0603FR-0739RL
R41 = R_SMD: RC0603FR-0743RL; ComponentLink1Description: chipdip; ComponentLink1URL: https://www.chipdip.ru/product0/9000079607; ComponentLink2Description: el; ComponentLink2URL: https://www.electronshik.ru/item/YAG/RC0603FR-0743RL
R42 = R_SMD: RC0603FR-072R2L; ComponentLink1Description: chipdip; ComponentLink1URL: https://www.chipdip.ru/product0/9000079549; ComponentLink2Description: el; ComponentLink2URL: https://www.electronshik.ru/item/YAG/RC0603FR-072R2L
R43 = R_SMD: RC0603FR-071RL; ComponentLink1Description: chipdip; ComponentLink1URL: https://www.chipdip.ru/product0/9000079509; ComponentLink2Description: el; ComponentLink2URL: https://www.electronshik.ru/item/YAG/RC0603FR-071RL
R45 = R_SMD: RC0603FR-0710RL; ComponentLink1Description: chipdip; ComponentLink1URL: https://www.chipdip.ru/product0/9000079557; ComponentLink2Description: el; ComponentLink2URL: https://www.electronshik.ru/item/YAG/RC0603FR-0710RL
R69 = R_SMD: RC0603FR-073K3L; ComponentLink1Description: chipdip; ComponentLink1URL: https://www.chipdip.ru/product0/9000079724; ComponentLink2Description: el; ComponentLink2URL: https://www.electronshik.ru/item/YAG/RC0603FR-073K3L
R70 = R_SMD: RC0603FR-077K5L; ComponentLink1Description: chipdip; ComponentLink1URL: https://www.chipdip.ru/product0/9000079733; ComponentLink2Description: el; ComponentLink2URL: https://www.electronshik.ru/item/YAG/RC0603FR-077K5L
R71 = R_SMD: RC0402FR-071KL; ComponentLink1Description: chipdip; ComponentLink1URL: https://www.chipdip.ru/product0/9000189652?from=suggest_product; ComponentLink2Description: el; ComponentLink2URL: https://www.electronshik.ru/item/YAG/RC0402FR-071KL
R72 = R_SMD: RC1206FR-071KL; ComponentLink1Description: chipdip; ComponentLink1URL: https://www.chipdip.ru/product0/9000079635; ComponentLink2Description: el; ComponentLink2URL: https://www.electronshik.ru/item/YAG/RC1206FR-071KL
R83 = R_SMD: RC0603FR-075K6L; ComponentLink1Description: chipdip; ComponentLink1URL: https://www.chipdip.ru/product1/8001784532; ComponentLink2Description: el; ComponentLink2URL: https://www.electronshik.ru/item/YAG/RC0603FR-075K6L
R84 = R_SMD: RC0603FR-072KL; ComponentLink1Description: chipdip; ComponentLink1URL: https://www.chipdip.ru/product0/9000079719; ComponentLink2Description: el; ComponentLink2URL: https://www.electronshik.ru/item/YAG/RC0603FR-072KL
S1-S3 S5 = KLS7-TS6606-8-180: 6x6 Tact Switch Series; ComponentLink1Description: kls7-ts6606-7.0_chipdip; ComponentLink1URL: https://www.chipdip.ru/product/kls7-ts6606-7.0-180-tc-0206; ComponentLink2Description: elitan-7.0; ComponentLink2URL: https://www.elitan.ru/price/item22675038
TP1-TP7 = Test_point: Test point for PCB
VD1 = SMF05C: 12.5V Clamp 8A _8/20µs_ Ipp Tvs Diode Surface Mount SC-88/SC70-6/SOT-363; MF: ON Semiconductor; Availability: Unavailable; Price: None; Package: SOT-363 ON Semiconductor; Value: *; SnapEDA_Link: https://www.snapeda.com/parts/SMF05C/ON%20Semiconductor/view-part/2782704/?ref=snap; MP: SMF05C; ComponentLink1Description: elitan; ComponentLink1URL: https://www.elitan.ru/price/item10155001; ComponentLink2Description: chipdip; ComponentLink2URL: https://www.chipdip.ru/product/smf05ct1g?from=suggest_product
VD2-VD4 VD8 VD9 VD17 = ESD9L5.0ST5G: TVS диод защитный 5В_пиковое_рабочее 9.8В_ограничение SOD923; ComponentLink1Description: elitan; ComponentLink2Description: chipdip
  VD2-VD4: ComponentLink1URL: https://www.elitan.ru/price/index.php?find=ESD9L5.0ST5G&delay=-1&mfg=all&seenform=y; ComponentLink2URL: https://www.chipdip.ru/product0/8001926257
  VD8 VD9 VD17: ComponentLink1URL: https://www.elitan.ru/price/item1205491; ComponentLink2URL: https://www.chipdip.ru/product1/8002974897?from=suggest_product
VD5 VD18 = ESDA6V1SC5: Сборка защитная TVS-диодов 5.25В_пиковое_ SOT23-5 / Unidirectional Channels 4 / Voltage - Reverse Standoff (Typ) 5.25V / Voltage - Breakdown (Min) 6.1V; MF: STMicroelectronics; MP: ESDA6V1W5; Value: *; SnapEDA_Link: https://www.snapeda.com/parts/ESDA6V1W5/STMicroelectronics/view-part/225154/?ref=snap; Availability: Unavailable; Package: SOT-323 STMicroelectronics; Price: None; ComponentLink1Description: elitan; ComponentLink1URL: https://www.elitan.ru/price/item317230; ComponentLink2Description: electronshik; ComponentLink2URL: https://www.electronshik.ru/item/ST/ESDA6V1SC5; ComponentLink3Description: chipdip; ComponentLink3URL: https://www.chipdip.ru/product0/8001797118?from=suggest_product
VD6 = SP0503BAHTG: TVS Diode-3 Рабочее напряжение 5.5 В / Максимальное напряжение фиксации 8.5 в; ComponentLink1Description: chipdip; ComponentLink1URL: https://www.chipdip.ru/product/sp0503bahtg; ComponentLink2Description: elitan; ComponentLink2URL: https://www.elitan.ru/price/item393293
VD7 = MMSZ5231B-TP: Стабилитрон 5.1В, 5%, 0.5Вт, [SOD-123]; ComponentLink1Description: chipdip; ComponentLink1URL: https://www.chipdip.ru/product/mmsz5231b-tp?from=suggest_product; ComponentLink2Description: elitan; ComponentLink2URL: https://www.elitan.ru/price/item685173
VD10 = LXES15AAA1-153: TVS диоды Подавители ЭСР / диоды для подавления переходных скачков напряжения ESD Protection Device; ComponentLink1Description: chipdip; ComponentLink1URL: https://www.chipdip.ru/product0/8001818635?from=suggest_product; ComponentLink2Description: elitan; ComponentLink2URL: https://www.elitan.ru/price/item11962267
VT1 = 2N7002: N-Channel MOSFET 60В 0.115А [SOT-23] /; ComponentLink1Description: chipdip; ComponentLink1URL: https://www.chipdip.ru/product/2n7002-tp-reel-3000; ComponentLink2Description: elitan; ComponentLink2URL: https://www.elitan.ru/price/item484309
VT2 VT3 = BC850B: Transistor, Npn, 0.1A, 50V, Vbe = 0.7V, hfe = 240 [ SOT23 ]; ComponentLink1Description: chipdip; ComponentLink1URL: https://www.chipdip.ru/product/bc850b?from=suggest_product; ComponentLink2Description: elitan; ComponentLink2URL: https://www.elitan.ru/price/item5642305
VT8-VT10 = BSS138: MOSFET, N-канал, 0.2А, 50В, [SOT-23]; ComponentLink1Description: chipdip; ComponentLink1URL: https://www.chipdip.ru/product/bss138-7-f-diodes?from=suggest_product; ComponentLink2Description: elitan; ComponentLink2URL: https://www.elitan.ru/price/item305174
VT11 = SI2308BDS-T1-GE3: MOSFET, N-канал 60В 1.9А [SOT-23]; ComponentLink1Description: chipdip; ComponentLink1URL: https://www.chipdip.ru/product/si2308bds-t1-ge3-vishay; ComponentLink2Description: electronshik; ComponentLink2URL: https://www.electronshik.ru/item/VISHAY/SI2308BDS-T1-GE3; ComponentLink3Description: elitan; ComponentLink3URL: https://www.elitan.ru/price/item668096
X1 = microSIM_Holder_5039600696: Соединители для карт памяти 1mm microSIM Push Push SMT; ComponentLink1Description: elitan; ComponentLink1URL: https://www.elitan.ru/price/item12310026
X2 = microSD_112J-TDAR-R: Разъем: для карт памяти; SD Micro; push-push; SMT; позолота; Manufacturer_Name: ATTEND; Datasheet Link: https://sds.compel.ru/item-pdf/04106748b1d2c9285eaa335c34b51c16/ps/attend~112j-tdar-r.pdf; Height: 1mm; Manufacturer_Part_Number: 112J-TDAR-R; ComponentLink1Description: chipdir; ComponentLink1URL: https://www.chipdip.ru/product0/8002703228; ComponentLink2Description: elitan; ComponentLink2URL: https://www.elitan.ru/price/item10898530
X3 = microUSB_1050170001: USB - micro B USB 2.0 Receptacle Connector 5 Position Surface Mount, Right Angle; Through Hole; MF: Molex; Digi-Key_Purchase_URL: https://www.digikey.com/product-detail/en/molex/1050170001/WM1399CT-ND/2350885?utm_source=snapeda&utm_medium=aggregator&utm_campaign=symbol; Digi-Key_Part_Number: WM1399CT-ND; Package: None; SnapEDA_Link: https://www.snapeda.com/parts/1050170001/Molex/view-part/2755530/?ref=snap; MP: 1050170001; Value: *; ComponentLink1Description: elitan; ComponentLink1URL: https://www.elitan.ru/price/item5116026; ComponentLink2Description: chipdip; ComponentLink2URL: https://www.chipdip.ru/product/105017-0001-molex?utm_source=google&utm_medium=cpc&position_type={position_type}|k50id|pla-293946777986|cid|11945324864|aid|488785225626|gid|115765259517&utm_campaign=G_tovarnieobjavlenija&utm_content=text1_ga&utm_term=
X4 = microJACK PY-401N: Гнездо моно 2.5мм; ComponentLink1Description: elitan; ComponentLink1URL: https://www.elitan.ru/price/index.php?find=PY-401N&delay=-1&mfg=all&seenform=y; ComponentLink2Description: chipdip; ComponentLink2URL: https://www.chipdip.ru/product/py-401n
X5 = miniJACK PY-601N: Аудио гнездо (М) 3.5мм; ComponentLink1Description: chipdip; ComponentLink1URL: https://www.chipdip.ru/product/py-601n?from=suggest_product; ComponentLink2Description: elitan; ComponentLink2URL: https://www.elitan.ru/price/index.php?find=PY-601N&delay=-1&mfg=all&seenform=y
X6 = DS1021_1x2: Вилка штыревая 2.54мм 1x2 прямая PLS-2; ComponentLink1Description: chipdip; ComponentLink1URL: https://www.chipdip.ru/product/pls-2; ComponentLink2Description: elitan; ComponentLink2URL: https://www.elitan.ru/price/item10669650
X7 = DS1013-14S: Вилка на плату прямая 14 конт. 2.54мм / ответная часть: DS1016-14MA2BB / или IDC-14F / шлейф DS1057-14A282R-30.5; ComponentLink1Description: smt-elitan; ComponentLink1URL: https://www.elitan.ru/price/item21920938; ComponentLink2Description: smt-electronshik; ComponentLink2URL: https://www.electronshik.ru/item/CONNFLY/DS1013-14MSIXA-B; ComponentLink3Description: smt-chipdip; ComponentLink3URL: https://www.chipdip.ru/product0/8160149550; ComponentLink4Description: IDC14-F-elitan; ComponentLink4URL: https://www.elitan.ru/price/item8570145; ComponentLink5Description: DS1016-14MA2BB-el; ComponentLink5URL: https://www.electronshik.ru/item/CONNFLY/DS1016-14MA2BB; ComponentLink6Description: шлейф-el; ComponentLink6URL: https://www.electronshik.ru/item/CONNFLY/DS1057-14A282R-30.5; ComponentLink7Description: шлейф-chipdip; ComponentLink7URL: https://www.chipdip.ru/product/ds1057-14-30
X8 = 2EDGR-5.08-02P: Клеммник разъемный угловой 2 конт., шаг 5.08 мм / (KLS2-EDR-5.08-02P-4) / 2EDGK-5.08-02P - ответная часть; ComponentLink1Description: chipdip; ComponentLink1URL: https://www.chipdip.ru/product/kls2-edr-5.08-02p-4-2edgr-5.08-02p; ComponentLink2Description: elitan; ComponentLink2URL: https://www.elitan.ru/price/item21239767; ComponentLink3Description: ответная-часть; ComponentLink3URL: https://www.elitan.ru/price/item130957; ComponentLink4Description: на-кабель; ComponentLink4URL: https://www.chipdip.ru/product/kls2-edk-5.08-02p-4s-2esdv-02p?from=suggest_product
X9 = U_FL-R-SMT-1_10: Разъем РЧ / 50 Ом Коаксиальный, UFL Коаксиальный, Прямое Гнездо, Вертикальный Поверхностный Монтаж SMT; ComponentLink1Description: elitan; ComponentLink1URL: https://www.elitan.ru/price/item1203541; ComponentLink2Description: chipdip; ComponentLink2URL: https://www.chipdip.ru/product0/9000586248?from=suggest_product
X10 = SMA-connector: Разъем угловой SMA гнездо на плату 50 Ом; ComponentLink1Description: platan-KLS1-SMA002-B; ComponentLink1URL: https://www.platan.ru/cgi-bin/qwery.pl/id=356964102; ComponentLink2Description: elitan-KLS1-SMA002; ComponentLink2URL: https://www.elitan.ru/price/item9893558

## Sheet Sh2_MCU.SchDoc
size A3
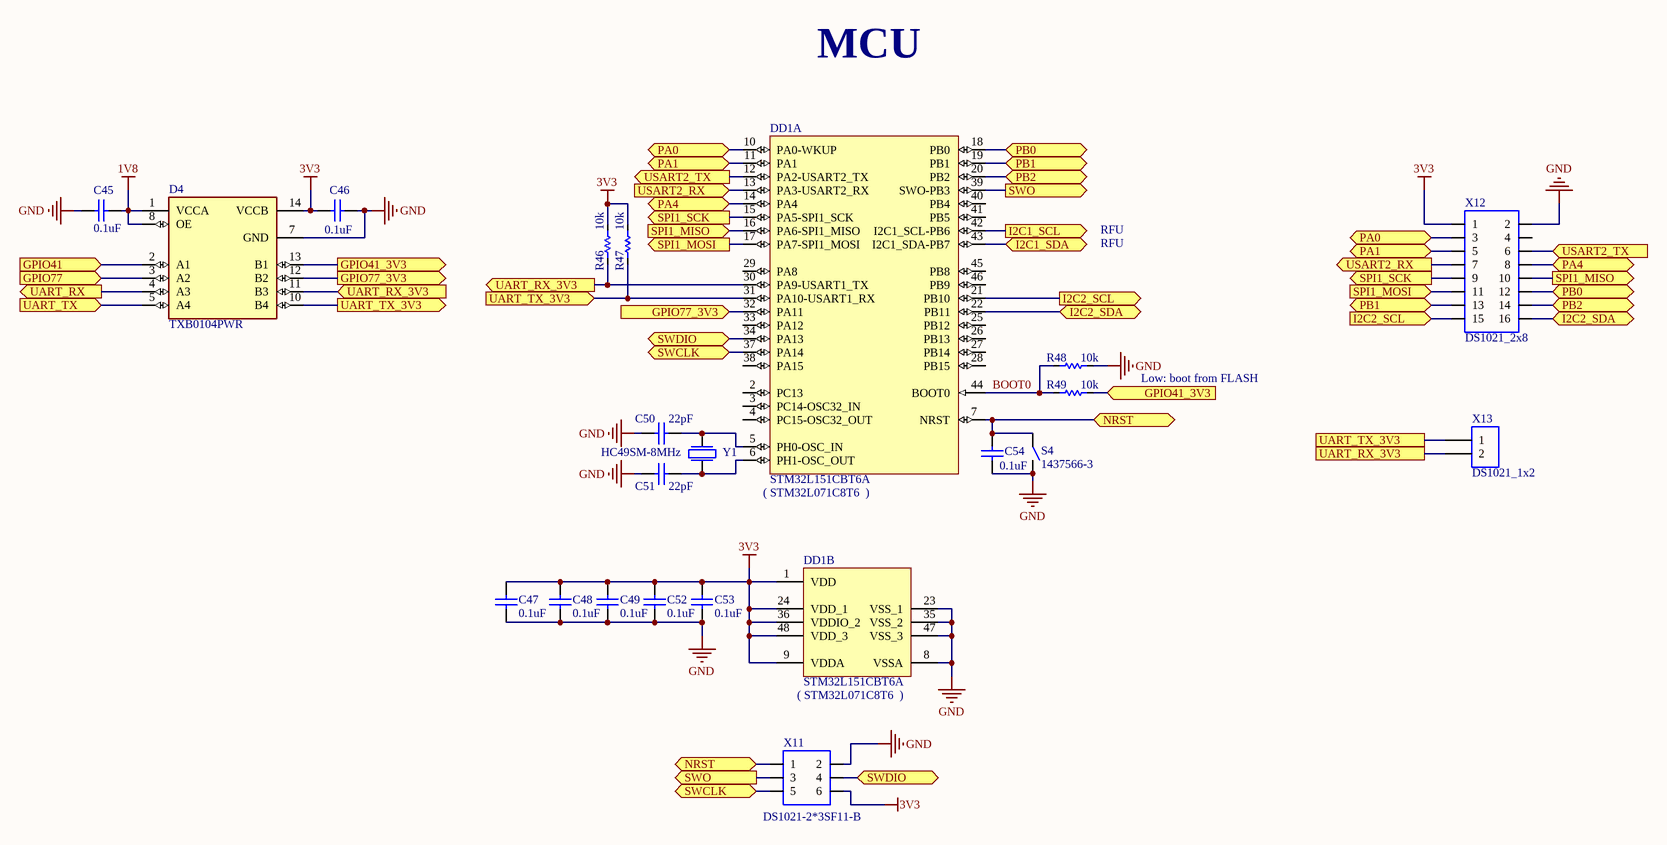
[diagram p2: Sh2_MCU.SchDoc]

### Parts
C45  0.1uF  [C_SMD0603]
C46  0.1uF  [C_SMD0603]
C47  0.1uF  [C_SMD0603]
C48  0.1uF  [C_SMD0603]
C49  0.1uF  [C_SMD0603]
C50  22pF  [C_SMD0603]
C51  22pF  [C_SMD0603]
C52  0.1uF  [C_SMD0603]
C53  0.1uF  [C_SMD0603]
C54  0.1uF  [C_SMD0603]
D4  TXB0104PWR  [SOP65P640X120-14N]
DD1  STM32L151CBT6A  [LQFP48_N]  (parts A,B of 2)
R46  10k  [R_SMD0603]
R47  10k  [R_SMD0603]
R48  10k  [R_SMD0603]
R49  10k  [R_SMD0603]
S4  1437566-3  [1437566-3]
X11  DS1021-2*3SF11-B  [PLD2-3]
X12  DS1021_2x8  [PLD2X8]
X13  DS1021_1x2  [PLD2]
Y1  HC49SM-8MHz  [HC49SM]

### Ports
GPIO41 (in), GPIO41_3V3 (in), GPIO41_3V3 (out), GPIO77 (in), GPIO77_3V3 (in), GPIO77_3V3 (out), I2C1_SCL (out), I2C1_SDA (bidir), I2C2_SCL (in), I2C2_SCL (out), I2C2_SDA (bidir), NRST (bidir), PA0 (bidir), PA1 (bidir), PA4 (bidir), PB0 (bidir), PB1 (bidir), PB2 (bidir), SPI1_MISO (in), SPI1_MISO (out), SPI1_MOSI (in), SPI1_MOSI (out), SPI1_SCK (out), SWCLK (bidir), SWDIO (bidir), SWO (out), UART_RX (out), UART_RX_3V3, UART_RX_3V3 (in), UART_RX_3V3 (out), UART_TX (in), UART_TX_3V3, UART_TX_3V3 (in), UART_TX_3V3 (out), USART2_RX (in), USART2_RX (out), USART2_TX (in), USART2_TX (out)

### Nets
1V8: C45.1 D4.1(VCCA) D4.8(OE)
3V3: C46.2 C47.1 C48.1 C49.1 C52.1 C53.1 D4.14(VCCB) DD1.1(VDD) DD1.9(VDDA) DD1.24(VDD_1) DD1.36(VDDIO_2) DD1.48(VDD_3) R46.1(CCW) R47.1(CCW) X11.6 X12.1
GND: C45.2 C46.1 C47.2 C48.2 C49.2 C50.1 C51.1 C52.2 C53.2 C54.2 D4.7(GND) DD1.8(VSSA) DD1.23(VSS_1) DD1.35(VSS_2) DD1.47(VSS_3) R48.2(CW) S4.2 X11.2 X12.2
BOOT0: DD1.44(BOOT0) R48.1(CCW) R49.1(CCW)
GPIO41: D4.2(A1) ; port GPIO41
GPIO41_3V3: D4.13(B1) R49.2(CW) ; port GPIO41_3V3
GPIO77: D4.3(A2) ; port GPIO77
GPIO77_3V3: D4.12(B2) DD1.32(PA11) ; port GPIO77_3V3
I2C1_SCL: DD1.42(I2C1_SCL-PB6) ; port I2C1_SCL
I2C1_SDA: DD1.43(I2C1_SDA-PB7) ; port I2C1_SDA
I2C2_SCL: DD1.21(PB10) X12.15 ; port I2C2_SCL
I2C2_SDA: DD1.22(PB11) X12.16 ; port I2C2_SDA
NRST: C54.1 DD1.7(NRST) S4.1 X11.1 ; port NRST
PA0: DD1.10(PA0-WKUP) X12.3 ; port PA0
PA1: DD1.11(PA1) X12.5 ; port PA1
PA4: DD1.14(PA4) X12.8 ; port PA4
PB0: DD1.18(PB0) X12.12 ; port PB0
PB1: DD1.19(PB1) X12.13 ; port PB1
PB2: DD1.20(PB2) X12.14 ; port PB2
SPI1_MISO: DD1.16(PA6-SPI1_MISO) X12.10 ; port SPI1_MISO
SPI1_MOSI: DD1.17(PA7-SPI1_MOSI) X12.11 ; port SPI1_MOSI
SPI1_SCK: DD1.15(PA5-SPI1_SCK) X12.9 ; port SPI1_SCK
SWCLK: DD1.37(PA14) X11.5 ; port SWCLK
SWDIO: DD1.34(PA13) X11.4 ; port SWDIO
SWO: DD1.39(SWO-PB3) X11.3 ; port SWO
UART_RX: D4.4(A3) ; port UART_RX
UART_RX_3V3: D4.11(B3) DD1.30(PA9-USART1_TX) R46.2(CW) X13.2 ; port UART_RX_3V3
UART_TX: D4.5(A4) ; port UART_TX
UART_TX_3V3: D4.10(B4) DD1.31(PA10-USART1_RX) R47.2(CW) X13.1 ; port UART_TX_3V3
USART2_RX: DD1.13(PA3-USART2_RX) X12.7 ; port USART2_RX
USART2_TX: DD1.12(PA2-USART2_TX) X12.6 ; port USART2_TX
NetC50_2: C50.2 DD1.5(PH0-OSC_IN) Y1.2
NetC51_2: C51.2 DD1.6(PH1-OSC_OUT) Y1.1

Not connected (* = marked no-connect by the designer): DD1 2(PC13) 3(PC14-OSC32_IN) 4(PC15-OSC32_OUT) 25(PB12) 26(PB13) 27(PB14) 28(PB15) 29(PA8) 33(PA12) 38(PA15) 40(PB4) 41(PB5) 45(PB8) 46(PB9); X12 4

### Notes on the sheet
- MCU
- RFU
- Low: boot from FLASH
- (near DD1) ( STM32L071C8T6  )
- Title
- Size:
- Date:
- A3
- Number:
- Time:
- Revision:
- Sheet
- of
- File:

### Library data of the parts
C45-C49 C52-C54 = C_SMD: GRM188R71H104KA93D; ComponentLink1Description: chipdip; ComponentLink1URL: https://www.chipdip.ru/product0/226236018; ComponentLink2Description: el; ComponentLink2URL: https://www.electronshik.ru/item/MUR/GRM188R71H104KA93D
C50 C51 = C_SMD: GRM1885C1H220JA01D; ComponentLink1Description: chipdip; ComponentLink1URL: https://www.chipdip.ru/product/grm1885c1h220j; ComponentLink2Description: el; ComponentLink2URL: https://www.electronshik.ru/item/MUR/GRM1885C1H220JA01D
D4 = TXB0104PWR: 4-Bit Bidirectional Voltage-Level Shifter with Auto Direction Sensing and +/-15 kV ESD Protect 14-TSSOP -40 to 85; MF: Texas Instruments; Availability: Unavailable; Texas_Instruments-Purchase-URL: https://snapeda.com/shop?store=Texas+Instruments&id=1077120; Package: TSSOP-14 Texas Instruments; MP: TXB0104PWR; SnapEDA_Link: https://www.snapeda.com/parts/TXB0104PWR/Texas%20Instruments/view-part/1077120/?ref=snap; Value: *; Price: None; ComponentLink1Description: elitan; ComponentLink1URL: https://www.elitan.ru/price/item703962
DD1 = STM32L151CBT6A: Analog - STM32L071C8T6 / Микроконтроллер 32-Бит, Cortex-M3, 32МГц, 128КБ Flash, LCD, USB, ADC, DAC [LQFP-48]; PartNumber: STM32F103C8T6; A/D Converter: 2x12-bit (10 Channel); Core: ARM Cortex-M3; FLASH Size (Prog) (kB): 64; I/Os (High Current): 37; Internal RAM Size (kB): 20; Operating Frequency(F) (Processor speed) (MHz): 72; Packing: Tray; Supply Voltage(Vcc) min (V): 2; DatasheetVersion: Rev. 16; PackageVersion: Rev. 6, 06/2013; PackageReference: LQFP48; PackageDescription: 48-Pin Low Profile Quad Flat Package, 7 x 7 mm Body, 0.5 mm Pitch; Supplier 1: Digi-Key; Supplier Part Number 1: 497-6063-ND; Supplier 2: Farnell; Supplier Part Number 2: 1447637; Supplier 3: Newark; Supplier Part Number 3: 59M2182; Supplier 4: Newark; Supplier Part Number 4: 57P1222; Supplier 5: Mouser; Supplier Part Number 5: 511-STM32F103C8T6; Mounting Technology: Surface Mount; ComponentLink1Description: elitan; ComponentLink1URL: https://www.elitan.ru/price/item11268663; ComponentLink2Description: chipdip; ComponentLink2URL: https://www.chipdip.ru/product/stm32l151cbt6a-2
R46-R49 = R_SMD: RC0603FR-0710KL (CRCW060310K0FKEA); ComponentLink1Description: chipdip; ComponentLink1URL: https://www.chipdip.ru/product0/9000079736; ComponentLink2Description: el; ComponentLink2URL: https://www.electronshik.ru/item/VISHAY/CRCW060310K0FKEA
S4 = 1437566-3: SMD button; ComponentLink1Description: chipdip; ComponentLink1URL: https://www.chipdip.ru/product/tyco-1437566-3-fsmsm?from=suggest_product; ComponentLink2Description: elitan; ComponentLink2URL: https://www.elitan.ru/price/item565583
X11 = DS1021_2x3: Вилка штыревая 2.54мм 2x3 прямая тип1; ComponentLink1Description: chipdip; ComponentLink1URL: https://www.chipdip.ru/product/pld-6; ComponentLink2Description: electronshik; ComponentLink2URL: https://www.electronshik.ru/item/CONNFLY/DS1021-2x3SF11-B
X12 = DS1021_2x8: Вилка штыревая 2.54мм 2х8 прямая PLD-16; ComponentLink1Description: chipdip; ComponentLink1URL: https://www.chipdip.ru/product/pld-16; ComponentLink2Description: elitan; ComponentLink2URL: https://www.elitan.ru/price/item14835380
X13 = DS1021_1x2: Вилка штыревая 2.54мм 1x2 прямая PLS-2; ComponentLink1Description: chipdip; ComponentLink1URL: https://www.chipdip.ru/product/pls-2; ComponentLink2Description: elitan; ComponentLink2URL: https://www.elitan.ru/price/item10669650
Y1 = HC49SM: 8 MHz resonator; ComponentLink1Description: 8MHz-chipdip; ComponentLink1URL: https://www.chipdip.ru/product/8mhz-hc-49sm; ComponentLink2Description: 8MHz-elitan; ComponentLink2URL: https://www.elitan.ru/price/item2093968